# EAGLE board InkTime_Schematic (EAGLE 9.7.0)
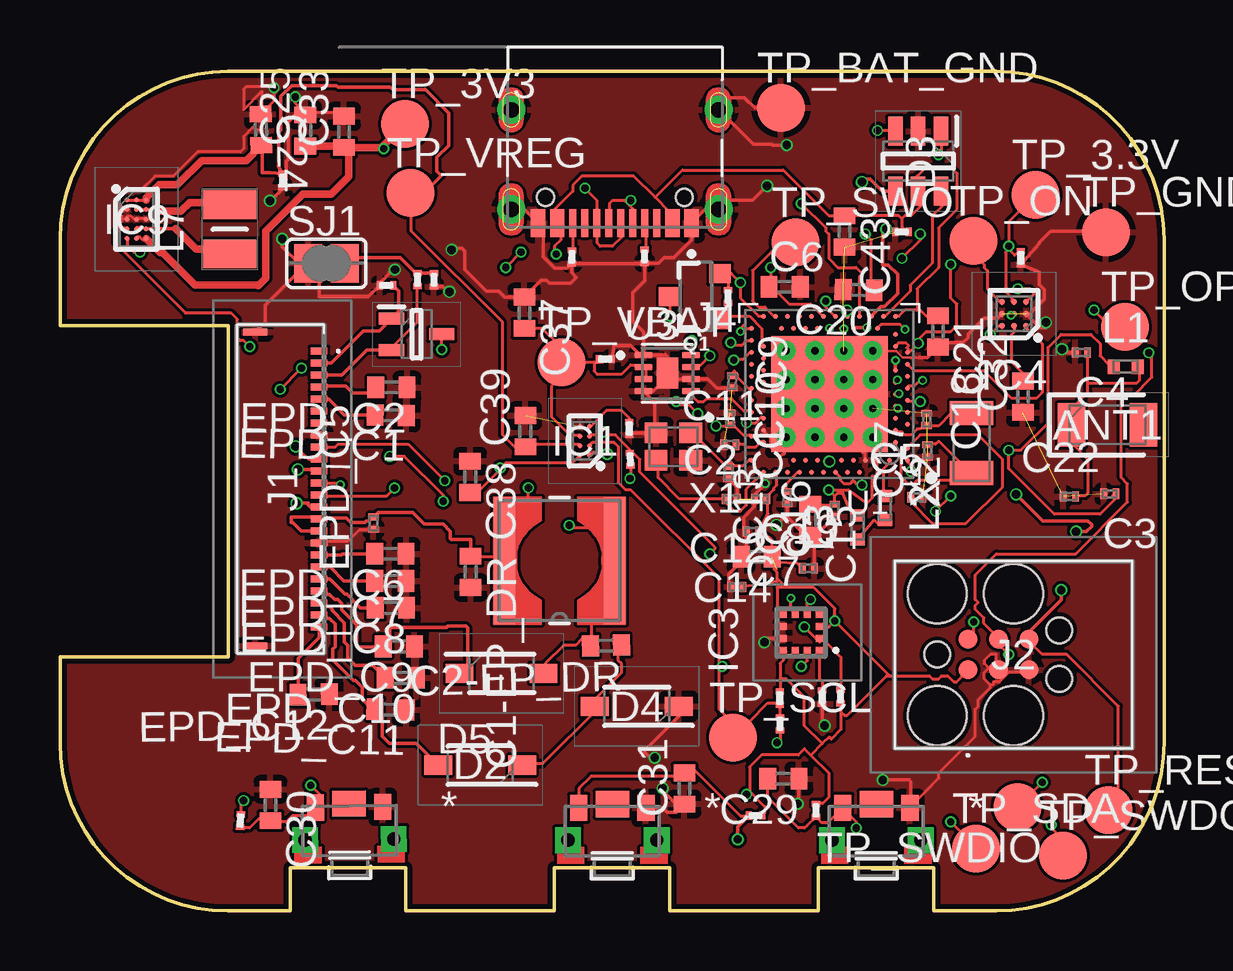
[diagram p2: board, top side]
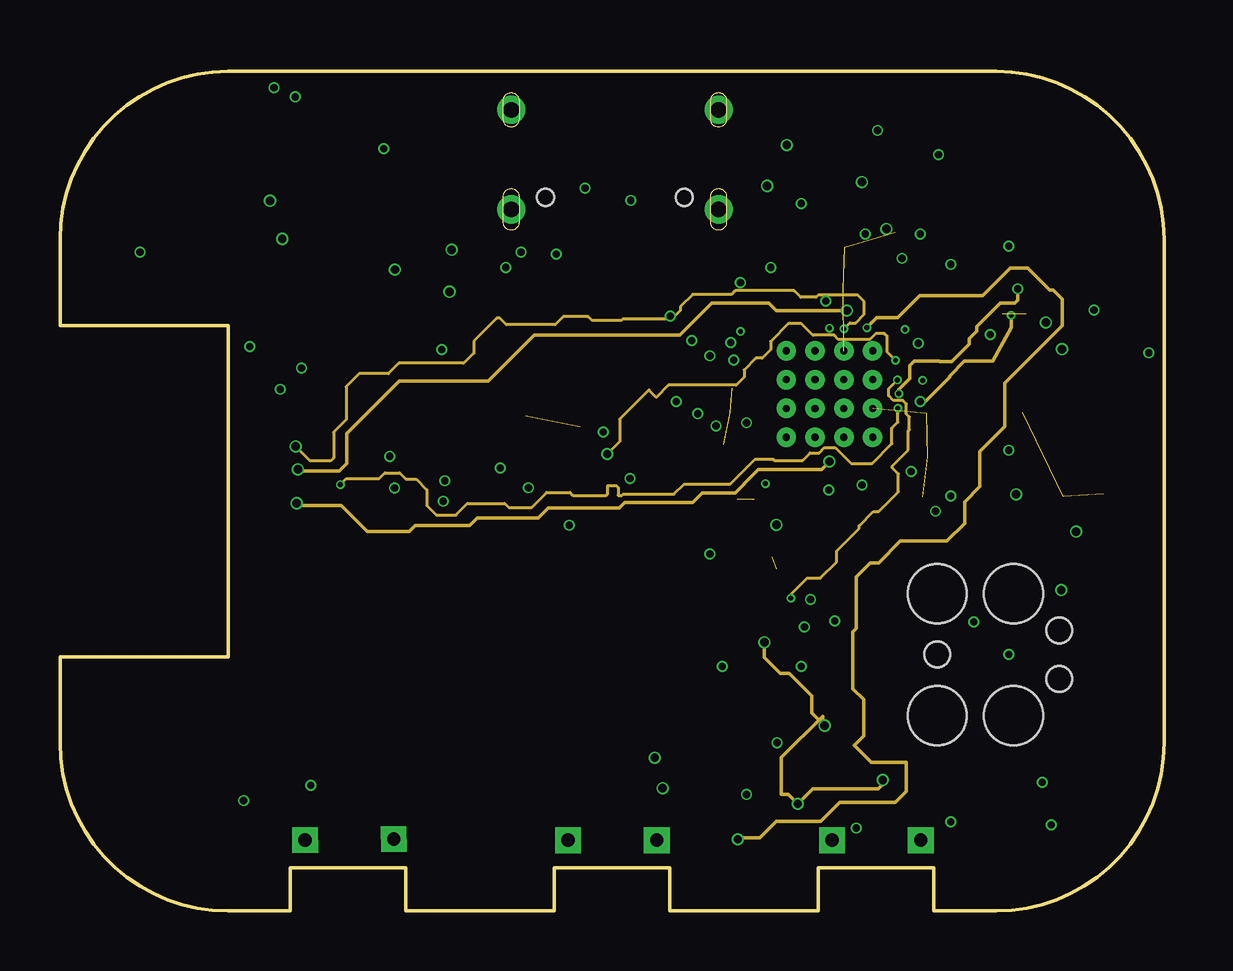
[diagram p3: board, inner layer Route2]
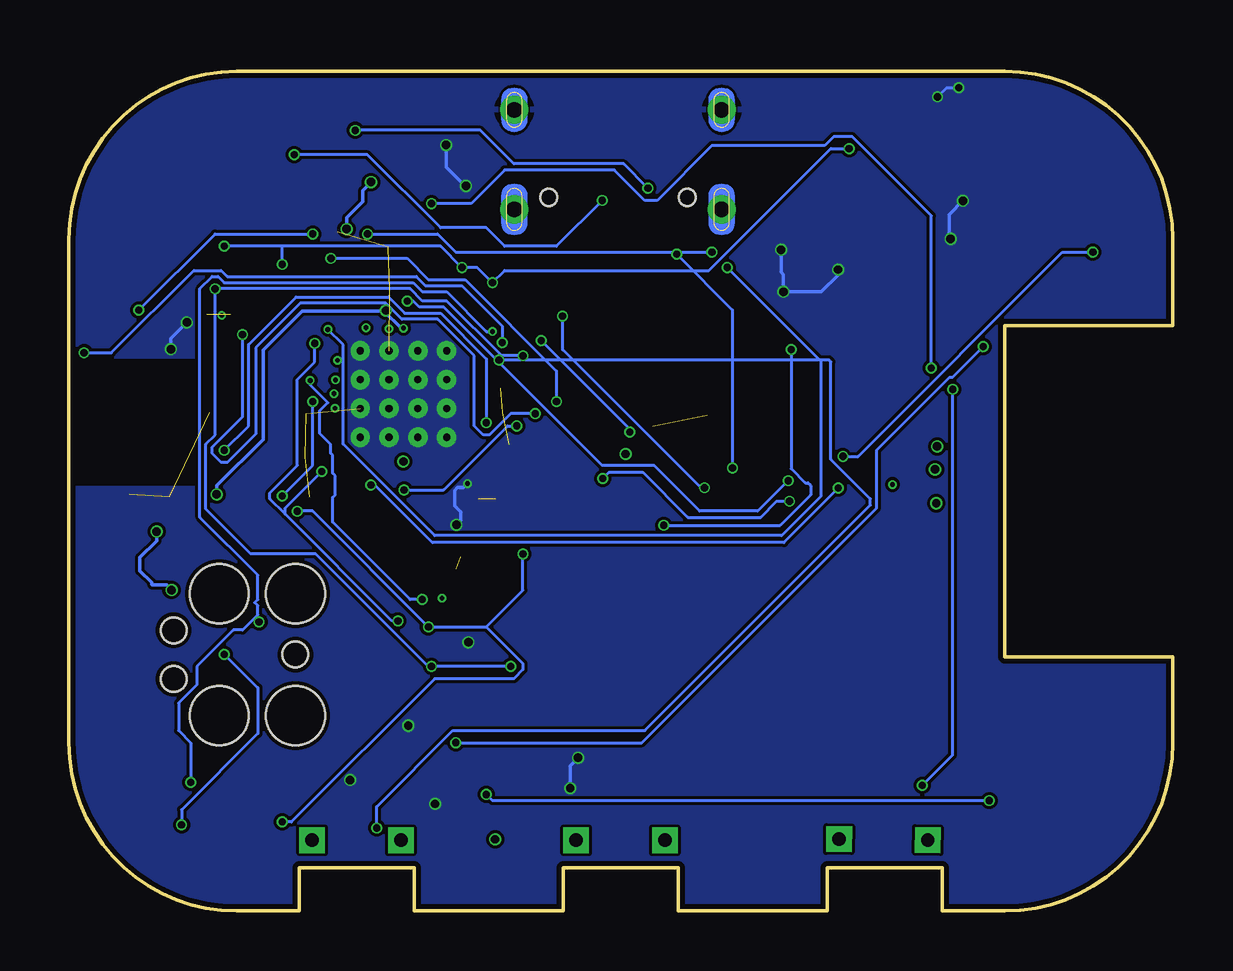
[diagram p4: board, bottom side, seen from below]

Size 46 x 35 mm. Coordinates in mm from the lower left corner, seen from the top.
Outline: 39,0 36.4,0 36.4,1.8 31.6,1.8 31.6,0 25.4,0 25.4,1.8 20.6,1.8 20.6,0 14.4,0 14.4,1.8 9.6,1.8 9.6,0 7,0 arc-90 0,7 0,10.6 7,10.6 7,24.4 0,24.4 0,28 arc-90 7,35 39,35 arc-90 46,28 46,7 arc-90 39,0
Copper layers (1+2*15+16): Top 0.035mm / dielectric 1.6mm / Route2 0.035mm / dielectric 0.15mm / Route15 0.035mm / dielectric 0.2mm / Bottom 0.035mm
Design rules "jlcpcb-2layers.dru *": minimum track width 0.06mm, minimum drill 0.2mm, track to track 5mil, track to pad 5mil, pad to pad 0.01mm, via to via 5mil, smd to smd 5mil, copper to edge 0.2mm, drill to drill 6mil, minimum pad ring 10mil, minimum via ring 3mil, stop-mask expansion 4mil, vias tented up to drill 0mil, thermal gap 10mil
bRestrict: area 40.8,17.7 to 46.4,23

## Footprints (pad centres in the part's own frame; a part is rotated, then mirrored left to right if it is on the bottom)
2450AT18B100E_ANTC3216X140N = smd 1.15 x 1.8: 1 -1.5,0; 2 1.5,0
NORDIC_NRF_3_RESC0201_L = smd 0.28 x 0.43: 1 -0.255,0; 2 0.255,0
ESP32_C6_LIBRARY_1_ESP32_WROVER_EAGLE-LTSPICE_C0402 = smd 0.7 x 0.9: 1 -0.65,0; 2 0.65,0
ERA-1AEB3401C_0201 = smd 0.35 x 0.25: 1 0,0.275; 2 0,-0.275
ESP32_C6_LIBRARY_5_SOD3716X135N = smd 1.15 x 0.8: 1 -1.75,0; 2 1.75,0
ESP32_C6_LIBRARY_3_SOT95P280X145-6N = smd 1.2 x 0.6: 1 -1.25,0.95; 2 -1.25,0; 3 -1.25,-0.95; 4 1.25,-0.95; 5 1.25,0; 6 1.25,0.95
BQ25180YBGR_BGA8C40P2X4_100X155X50 = smd 0.2 x 0.2: A1 -0.2,0.6; A2 0.2,0.6; B1 -0.2,0.2; B2 0.2,0.2; C1 -0.2,-0.2; C2 0.2,-0.2; D1 -0.2,-0.6; D2 0.2,-0.6
BMA423_BMA423 = smd 0.3 x 0.35: 1 -0.75,-0.775; 2 -0.25,-0.775; 3 0.25,-0.775; 4 0.75,-0.775; 7 0.75,0.775; 8 0.25,0.775; 9 -0.25,0.775; 10 -0.75,0.775 | smd 0.35 x 0.3: 5 0.775,-0.25; 6 0.775,0.25; 11 -0.775,0.25; 12 -0.775,-0.25
DRV2605YZFR_BGA9C50P3X3_144X144X62 = smd 0.25 x 0.25: A1 -0.5,0.5; A2 0,0.5; A3 0.5,0.5; B1 -0.5,0; B2 0,0; B3 0.5,0; C1 -0.5,-0.5; C2 0,-0.5; C3 0.5,-0.5
RT6160AWSC_BGA15C40P3X5_140X230X60 = smd 0.216 x 0.216: A1 -0.4,0.8; A2 0,0.8; A3 0.4,0.8; B1 -0.4,0.4; B2 0,0.4; B3 0.4,0.4; C1 -0.4,0; C2 0,0; C3 0.4,0; D1 -0.4,-0.4; D2 0,-0.4; D3 0.4,-0.4; E1 -0.4,-0.8; E2 0,-0.8; E3 0.4,-0.8
503480-2400_5034802400 = smd 0.3 x 0.7: 1 -5.75,1.525; 2 -5.25,1.525; 3 -4.75,1.525; 4 -4.25,1.525; 5 -3.75,1.525; 6 -3.25,1.525; 7 -2.75,1.525; 8 -2.25,1.525; 9 -1.75,1.525; 10 -1.25,1.525; 11 -0.75,1.525; 12 -0.25,1.525; 13 0.25,1.525; 14 0.75,1.525; 15 1.25,1.525; 16 1.75,1.525; 17 2.25,1.525; 18 2.75,1.525; 19 3.25,1.525; 20 3.75,1.525; 21 4.25,1.525; 22 4.75,1.525; 23 5.25,1.525; 24 5.75,1.525 | smd 0.3 x 1: MP1 -6.54,-1.125; MP2 6.54,-1.125
TC2030-IDC_TC2030IDC = smd 0.783 x 0.783: 1 -0.953,-0.635; 2 -0.953,0.635; 3 0.317,-0.635; 4 0.317,0.635; 5 1.588,-0.635; 6 1.588,0.635 | hole 2.451: -2.223,-2.54; -2.223,2.54; 0.952,-2.54; 0.952,2.54 | hole 1.067: -2.223,0; 2.857,-1.016; 2.857,1.016
KH-TYPE-C-16P_KINGHELM_KH-TYPE-C-16P = smd 0.6 x 1.15: A1_B12 -3.2,4.725; A4_B9 -2.4,4.725; A9_B4 2.4,4.725; A12_B1 3.2,4.725 | smd 0.3 x 1.15: A5 -1.25,4.725; A6 -0.25,4.725; A7 0.25,4.725; A8 1.25,4.725; B5 1.75,4.725; B6 0.75,4.725; B7 -0.75,4.725; B8 -1.75,4.725 | drill 0.65 pad 1.05: SH1 -4.32,0; SH2 4.32,0; SH3 -4.32,4.15; SH4 4.32,4.15 | hole 0.7: -2.89,3.65; 2.89,3.65
NORDIC_NRF_2_RESC0402_L = smd 0.5 x 0.6: 1 -0.5,0; 2 0.5,0
ESP32_C6_LIBRARY_2_IND_4828-WE-TPC_WRE = smd 0.9 x 5.3: 1 -2.286,0; 2 2.286,0
MLP2016SR47MT0S1_INDC2016X100N = smd 1.2 x 2.2: 1 -1.028,0; 2 1.028,0
ESP32_C6_LIBRARY_4_ESP32_C6_LIBRARY_4_ESP32_C6_LIBRARY_4_ESP32_C6_LIBRARY_4_ESP32_WROVER_SPARKFUN-DISCRETESEMI_SOT23-3 = smd 0.8 x 0.9: 1 -0.95,-1; 2 0.95,-1; 3 0,1.1
ESP32_C6_LIBRARY_6_SOT65P210X110-3N = smd 1.05 x 0.5: 1 -1.05,0.65; 2 -1.05,-0.65; 3 1.05,0
CPF0201D7K68C1_0201 = smd 0.35 x 0.25: 1 0,0.275; 2 0,-0.275
ESP32_C6_LIBRARY_7_JUMPER_SJ = smd 1.168 x 1.6: 1 -0.762,0; 2 0.762,0
2025-10-22_07-23-44_LIBRARY_SW_EVP-AKE31A_PAN = smd 0.711 x 1.092: 1 -1.4,-0.972; 2 1.4,-0.972 | drill 0.559 pad 0.914 square: 3 -1.848,0.381; 4 1.848,0.381 | smd 1.397 x 1.092: 5 0,-1.124
HECTOR_WATCH_1_TP20R = smd 2 x 2: TP 0,0
NORDIC_NRF_4_AQFN50P700X700X85_HS-74N = smd 4.85 x 4.85: P$74 0,0 | drill 0.3 pad 0.6: P$75 -1.8,1.8; P$76 -0.6,1.8; P$77 0.6,1.8; P$78 1.8,1.8; P$79 -1.8,0.6; P$80 -0.6,0.6; P$81 0.6,0.6; P$82 1.8,0.6; P$83 -1.8,-0.6; P$84 -0.6,-0.6; P$85 0.6,-0.6; P$86 1.8,-0.6; P$87 -1.8,-1.8; P$88 -0.6,-1.8; P$89 0.6,-1.8; P$90 1.8,-1.8 | smd 0.2 x 0.2: P$A8 -1.25,3.25; P$A10 -0.75,3.25; P$A12 -0.25,3.25; P$A14 0.25,3.25; P$A16 0.75,3.25; P$A18 1.25,3.25; P$A20 1.75,3.25; P$A22 2.25,3.25; P$A23 2.75,3.25; P$AA24 3.25,-2.25; P$AB2 -2.75,-2.5; P$AC5 -2,-2.75; P$AC9 -1,-2.75; P$AC11 -0.5,-2.75; P$AC13 0,-2.75; P$AC15 0.5,-2.75; P$AC17 1,-2.75; P$AC19 1.5,-2.75; P$AC21 2,-2.75; P$AC24 3.25,-2.75; P$AD2 -2.75,-3.25; P$AD4 -2.25,-3.25; P$AD6 -1.75,-3.25; P$AD8 -1.25,-3.25; P$AD10 -0.75,-3.25; P$AD12 -0.25,-3.25; P$AD14 0.25,-3.25; P$AD16 0.75,-3.25; P$AD18 1.25,-3.25; P$AD20 1.75,-3.25; P$AD22 2.25,-3.25; P$AD23 2.75,-3.25; P$B1 -3.25,2.75; P$B3 -2.5,2.75; P$B5 -2,2.75; P$B7 -1.5,2.75; P$B9 -1,2.75; P$B11 -0.5,2.75; P$B13 0,2.75; P$B15 0.5,2.75; P$B17 1,2.75; P$B19 1.5,2.75; P$B24 3.25,2.75; P$C1 -3.25,2.25; P$D2 -2.75,2; P$D23 2.75,2; P$E24 3.25,1.75; P$F2 -2.75,1.5; P$F23 2.75,1.5; P$G1 -3.25,1.25; P$H2 -2.75,1; P$H23 2.75,1; P$J1 -3.25,0.75; P$J24 3.25,0.75; P$K2 -2.75,0.5; P$L1 -3.25,0.25; P$L24 3.25,0.25; P$M2 -2.75,0; P$N1 -3.25,-0.25; P$N24 3.25,-0.25; P$P2 -2.75,-0.5; P$P23 2.75,-0.5; P$R1 -3.25,-0.75; P$R24 3.25,-0.75; P$T2 -2.75,-1; P$T23 2.75,-1; P$U1 -3.25,-1.25; P$U24 3.25,-1.25; P$V23 2.75,-1.5; P$W1 -3.25,-1.75; P$W24 3.25,-1.75; P$Y2 -2.75,-2; P$Y23 2.75,-2
ESP32_C6_LIBRARY_SON50P200X200X80-9N = smd 0.76 x 0.27: 1 -0.985,0.75; 2 -0.985,0.25; 3 -0.985,-0.25; 4 -0.985,-0.75; 5 0.985,-0.75; 6 0.985,-0.25; 7 0.985,0.25; 8 0.985,0.75 | smd 0.9 x 1.3: 9 0,0
NORDIC_NRF_BT-XTAL_2016_N = smd 0.95 x 0.85: 1 -0.725,-0.575; 2 0.725,-0.575; 3 0.725,0.575; 4 -0.725,0.575
NORDIC_NRF_1_XTAL_3215_N = smd 1 x 1.8: 1 -1.25,0; 2 1.25,0

## Placement (x,y rotation side)
ANT1  2450AT18B100E  [2450AT18B100E_ANTC3216X140N]  43.65,20.27 0 top
C1  12pF  [NORDIC_NRF_3_RESC0201_L]  27.85,18.27 270 top
C1-EP_DR  10uF  [ESP32_C6_LIBRARY_1_ESP32_WROVER_EAGLE-LTSPICE_C0402]  17.11,14.14 270 top
C2  12pF  [NORDIC_NRF_3_RESC0201_L]  27.96,17.18 0 top
C2-EP_DR  4.7uF/25V  [ESP32_C6_LIBRARY_1_ESP32_WROVER_EAGLE-LTSPICE_C0402]  22.75,11.07 181.5 top
C3  1pF  [NORDIC_NRF_3_RESC0201_L]  43.74,17.39 180 top
C4  1pF  [NORDIC_NRF_3_RESC0201_L]  42.56,23.28 180 top
C5  100nF  [NORDIC_NRF_3_RESC0201_L]  35.7,17.25 0 top
C6  4.7μF  [ESP32_C6_LIBRARY_1_ESP32_WROVER_EAGLE-LTSPICE_C0402]  30.19,26.02 0 top
C7  100nF  [NORDIC_NRF_3_RESC0201_L]  28.85,15.82 180 top
C8  100nF  [NORDIC_NRF_3_RESC0201_L]  29.19,17.18 180 top
C9  820pF N.C.  [NORDIC_NRF_3_RESC0201_L]  28.01,22.06 268.5 top
C10  N.C.  [NORDIC_NRF_3_RESC0201_L]  27.93,20.52 270 top
C11  100pF  [NORDIC_NRF_3_RESC0201_L]  27.91,19.44 0 top
C12  100nF  [NORDIC_NRF_3_RESC0201_L]  28.2,13.51 0 top
C13  N.C.  [NORDIC_NRF_3_RESC0201_L]  30.3,17.23 89.8 top
C14  4.7μF  [ESP32_C6_LIBRARY_1_ESP32_WROVER_EAGLE-LTSPICE_C0402]  29.03,14.77 180 top
C15  1.0μF  [ESP32_C6_LIBRARY_1_ESP32_WROVER_EAGLE-LTSPICE_C0402]  31.26,16.31 270 top
C16  47nF  [NORDIC_NRF_3_RESC0201_L]  32.28,16.7 90 top
C17  12pF  [NORDIC_NRF_3_RESC0201_L]  36.15,19.18 90 top
C18  12pF  [NORDIC_NRF_3_RESC0201_L]  36.11,20.49 270 top
C19  100nF  [NORDIC_NRF_3_RESC0201_L]  31.18,14.29 0 top
C20  4.7μF  [ESP32_C6_LIBRARY_1_ESP32_WROVER_EAGLE-LTSPICE_C0402]  33.28,25.89 178.5 top
C21  4.7μF  [ESP32_C6_LIBRARY_1_ESP32_WROVER_EAGLE-LTSPICE_C0402]  36.58,24.16 269.8 top
C22  N.C.  [NORDIC_NRF_3_RESC0201_L]  42.05,17.28 0 top
C23  0.1uF  [ERA-1AEB3401C_0201]  9.27,30.46 180 top
C24  10uF  [ESP32_C6_LIBRARY_1_ESP32_WROVER_EAGLE-LTSPICE_C0402]  8.37,32.57 271.6 top
C25  22uF  [ESP32_C6_LIBRARY_1_ESP32_WROVER_EAGLE-LTSPICE_C0402]  10.22,32.54 90 top
C27  0.1uF  [ERA-1AEB3401C_0201]  22.72,23.01 270 top
C29  1uF  [ESP32_C6_LIBRARY_1_ESP32_WROVER_EAGLE-LTSPICE_C0402]  30.14,5.52 180 top
C30  1uF  [ESP32_C6_LIBRARY_1_ESP32_WROVER_EAGLE-LTSPICE_C0402]  8.77,4.42 270 top
C31  1uF  [ESP32_C6_LIBRARY_1_ESP32_WROVER_EAGLE-LTSPICE_C0402]  26.02,5.11 90 top
C32  1uF  [ESP32_C6_LIBRARY_1_ESP32_WROVER_EAGLE-LTSPICE_C0402]  40.12,21.44 90 top
C33  22uF  [ESP32_C6_LIBRARY_1_ESP32_WROVER_EAGLE-LTSPICE_C0402]  11.83,32.48 90 top
C34  0.1uF  [ERA-1AEB3401C_0201]  40.03,27.23 180 top
C37  1uF  [ESP32_C6_LIBRARY_1_ESP32_WROVER_EAGLE-LTSPICE_C0402]  19.35,24.94 270 top
C38  1uF  [ESP32_C6_LIBRARY_1_ESP32_WROVER_EAGLE-LTSPICE_C0402]  17.09,18.1 270 top
C39  10uF  [ESP32_C6_LIBRARY_1_ESP32_WROVER_EAGLE-LTSPICE_C0402]  19.39,20 90 top
C42  0.1uF  [ERA-1AEB3401C_0201]  35.08,28.31 270 top
C43  4.7uF  [ESP32_C6_LIBRARY_1_ESP32_WROVER_EAGLE-LTSPICE_C0402]  32.69,28.33 270 top
D2  MBR0530  [ESP32_C6_LIBRARY_5_SOD3716X135N]  17.51,6.08 180 top
D3  USBLC6-2SC6Y  [ESP32_C6_LIBRARY_3_SOT95P280X145-6N]  35.76,31.26 270 top
D4  MBR0530  [ESP32_C6_LIBRARY_5_SOD3716X135N]  24.03,8.53 180 top
D5  MBR0530  [ESP32_C6_LIBRARY_5_SOD3716X135N]  18.4,9.91 0 top
EPD_C1  1uF/50V  [ESP32_C6_LIBRARY_1_ESP32_WROVER_EAGLE-LTSPICE_C0402]  13.78,20.67 178.9 top
EPD_C2  1uF/50V  [ESP32_C6_LIBRARY_1_ESP32_WROVER_EAGLE-LTSPICE_C0402]  13.81,21.83 180 top
EPD_C5  0.1uF/50V  [NORDIC_NRF_3_RESC0201_L]  13.06,16.17 90 top
EPD_C6  1uF/50V  [ESP32_C6_LIBRARY_1_ESP32_WROVER_EAGLE-LTSPICE_C0402]  13.77,14.89 180 top
EPD_C7  1uF/50V  [ESP32_C6_LIBRARY_1_ESP32_WROVER_EAGLE-LTSPICE_C0402]  13.77,13.76 180 top
EPD_C8  1uF/50V  [ESP32_C6_LIBRARY_1_ESP32_WROVER_EAGLE-LTSPICE_C0402]  13.79,12.64 180 top
EPD_C9  1uF/50V  [ESP32_C6_LIBRARY_1_ESP32_WROVER_EAGLE-LTSPICE_C0402]  14.12,11.03 180 top
EPD_C10  1uF/50V  [ESP32_C6_LIBRARY_1_ESP32_WROVER_EAGLE-LTSPICE_C0402]  14.2,9.72 180 top
EPD_C11  1uF/50V  [ESP32_C6_LIBRARY_1_ESP32_WROVER_EAGLE-LTSPICE_C0402]  13.77,8.4 178.9 top
EPD_C12  1uF/50V  [ESP32_C6_LIBRARY_1_ESP32_WROVER_EAGLE-LTSPICE_C0402]  10.57,9.03 180.7 top
IC1  BQ25180YBGR  [BQ25180YBGR_BGA8C40P2X4_100X155X50]  21.87,19.6 180 top
IC3  BMA421  [BMA423_BMA423]  30.88,11.61 90 top
IC4  DRV2605YZFR  [DRV2605YZFR_BGA9C50P3X3_144X144X62]  39.75,24.89 180 top
IC9  RT6160AWSC  [RT6160AWSC_BGA15C40P3X5_140X230X60]  3.19,28.84 0 top
J1  503480-2400  [503480-2400_5034802400]  9.27,17.59 270 top
J2  TC2030-IDC  [TC2030-IDC_TC2030IDC]  38.78,10.69 0 top
J4  KH-TYPE-C-16P  [KH-TYPE-C-16P_KINGHELM_KH-TYPE-C-16P]  23.12,33.4 180 top
L1  3.9nH  [NORDIC_NRF_2_RESC0402_L]  44.4,22.69 0 top
L2  10uH  [NORDIC_NRF_2_RESC0402_L]  34.37,16.8 270 top
L3  15nH  [NORDIC_NRF_2_RESC0402_L]  33.23,15.99 90 top
L5  68uH  [ESP32_C6_LIBRARY_2_IND_4828-WE-TPC_WRE]  20.81,14.61 180 top
L7  FTC252012SR47MBCA  [MLP2016SR47MT0S1_INDC2016X100N]  7.07,28.42 270 top
Q1  20V/4.2A/52mΩ/1.4W  [ESP32_C6_LIBRARY_4_ESP32_C6_LIBRARY_4_ESP32_C6_LIBRARY_4_ESP32_C6_LIBRARY_4_ESP32_WROVER_SPARKFUN-DISCRETESEMI_SOT23-3]  26.5,25.62 90 top
Q3  SI1308EDL-T1-GE3  [ESP32_C6_LIBRARY_6_SOT65P210X110-3N]  14.86,24.04 0 top
R1_EP_DR  0.47  [CPF0201D7K68C1_0201]  14.9,26.32 0.3 top
R1_USB  5K1  [ERA-1AEB3401C_0201]  24.36,27.29 180 top
R2  0  [CPF0201D7K68C1_0201]  23.76,18.83 2.8 top
R2_EP_DR  10K  [CPF0201D7K68C1_0201]  13.6,26.08 90 top
R2_USB  5K1  [ERA-1AEB3401C_0201]  21.33,27.27 358.6 top
R3  0  [CPF0201D7K68C1_0201]  31.76,8.92 180 top
R4  0  [CPF0201D7K68C1_0201]  30,7.8 0 top
R5  10K  [ERA-1AEB3401C_0201]  7.52,3.77 176.7 top
R7  10K  [ERA-1AEB3401C_0201]  31.5,4.2 180 top
R8  10K  [ERA-1AEB3401C_0201]  28.98,3.98 91.2 top
R9  10K  [CPF0201D7K68C1_0201]  23.72,20.11 180 top
R17  3K3  [CPF0201D7K68C1_0201]  29.99,8.87 0 top
R18  3K3  [CPF0201D7K68C1_0201]  32.52,8.94 180 top
R_PWR_EPD  10K  [CPF0201D7K68C1_0201]  27.84,25.62 180 top
R_TYPE_SEL  2.2  [CPF0201D7K68C1_0201]  15.58,26.31 180 top
SJ1  [ESP32_C6_LIBRARY_7_JUMPER_SJ]  11.1,27 0 top
SW_DN  2025-10-22_07-23-44_LIBRARY_EVP-AKE31ASW_EVP-AKE31A_PAN  [2025-10-22_07-23-44_LIBRARY_SW_EVP-AKE31A_PAN]  34.02,3.33 180 top
SW_ENT  2025-10-22_07-23-44_LIBRARY_EVP-AKE31ASW_EVP-AKE31A_PAN  [2025-10-22_07-23-44_LIBRARY_SW_EVP-AKE31A_PAN]  23.02,3.33 180 top
SW_UP  2025-10-22_07-23-44_LIBRARY_EVP-AKE31ASW_EVP-AKE31A_PAN  [2025-10-22_07-23-44_LIBRARY_SW_EVP-AKE31A_PAN]  12.06,3.36 180.6 top
TP_3.3V  HECTOR_WATCH_1_TPTP20R  [HECTOR_WATCH_1_TP20R]  40.65,29.86 0 top
TP_3V3  HECTOR_WATCH_1_TPTP20R  [HECTOR_WATCH_1_TP20R]  14.37,32.82 0 top
TP_BAT_GND  HECTOR_WATCH_1_TPTP20R  [HECTOR_WATCH_1_TP20R]  30.04,33.48 0 top
TP_GND  HECTOR_WATCH_1_TPTP20R  [HECTOR_WATCH_1_TP20R]  43.58,28.3 0 top
TP_ON  HECTOR_WATCH_1_TPTP20R  [HECTOR_WATCH_1_TP20R]  38.07,27.93 0 top
TP_OP  HECTOR_WATCH_1_TPTP20R  [HECTOR_WATCH_1_TP20R]  44.37,24.36 0 top
TP_RESET  HECTOR_WATCH_1_TPTP20R  [HECTOR_WATCH_1_TP20R]  43.68,4.21 0 top
TP_SCL  HECTOR_WATCH_1_TPTP20R  [HECTOR_WATCH_1_TP20R]  28.04,7.22 0 top
TP_SDA  HECTOR_WATCH_1_TPTP20R  [HECTOR_WATCH_1_TP20R]  38.17,2.61 0 top
TP_SWDCLK  HECTOR_WATCH_1_TPTP20R  [HECTOR_WATCH_1_TP20R]  41.8,2.31 0 top
TP_SWDIO  HECTOR_WATCH_1_TPTP20R  [HECTOR_WATCH_1_TP20R]  39.9,4.34 180 top
TP_SWO  HECTOR_WATCH_1_TPTP20R  [HECTOR_WATCH_1_TP20R]  30.65,27.87 0 top
TP_VBAT  HECTOR_WATCH_1_TPTP20R  [HECTOR_WATCH_1_TP20R]  20.9,22.88 0 top
TP_VREG  HECTOR_WATCH_1_TPTP20R  [HECTOR_WATCH_1_TP20R]  14.6,29.93 0 top
U1  NRF52840_QF  [NORDIC_NRF_4_AQFN50P700X700X85_HS-74N]  32.06,21.55 180 top
U3  MAX17048G+T10  [ESP32_C6_LIBRARY_SON50P200X200X80-9N]  25.3,22.42 0 top
X1  32MHz  [NORDIC_NRF_BT-XTAL_2016_N]  25.56,19.36 180 top
X2  32.768kHz  [NORDIC_NRF_1_XTAL_3215_N]  37.98,19.52 90 top

## Tracks (layer width: path | path; a pad name or v marks a point on that pad's centre or on a via)
3V3  (via drill 0.3)  (1 unrouted)
  Top 0.127: 39.53,27.59 39.78,27.34 C34.2 | 39.53,27.59 v39.53,27.72 39.53,28.73 40.54,29.75 TP_3.3V.TP | 39.53,27.59 39.4,27.46 39.4,25.81 39.65,25.56 39.65,25.43 IC4.C2 | 29.62,26.07 30.38,25.3 31.27,25.3 31.78,24.8 U1.P$AD14 | IC9.E2 3.2,28.1 3.33,28.1 3.46,27.97 IC9.E3 | 27.84,26.57 27.59,26.57 Q1.2 27.84,26.57 | 27.84,26.57 27.97,26.57 v28.35,26.19 28.35,25.56 29.11,24.8 29.24,24.8 U1.P$AD23 | v13.49,31.78 13.38,31.83 | 27.84,26.57 27.84,25.94 R_PWR_EPD.2 | v29.62,26.83 29.62,26.07 | 29.62,26.07 C6.1 | 30.13,13.49 30.13,13.62 29.87,13.88 | IC3.7 29.88,12.59 29.88,13.49 30.13,13.49 | 29.87,13.88 29.87,13.74 C12.2 | 29.87,13.88 29.87,14.13 29.75,14.26 29.86,14.26 | C19.1 30.73,14.49 29.86,14.53 29.86,14.68 C14.1 29.65,15.5 29.64,15.51 C7.1 29.49,16.59 29.49,17.18 C8.1 29.41,17.23 29.75,17.57 29.75,17.64 29.87,17.77 29.87,18.32 U1.P$A22 | 35.41,23.35 35.43,23.33 35.59,23.5 | 35.41,23.35 35.27,23.48 35.36,23.57 35.26,23.68 34.94,23.68 U1.P$Y2 | v35.46,18.32 35.59,18.45 35.34,18.7 U1.P$B1 | v32.29,12.1 32.03,11.84 31.78,11.84 IC3.3 | 35.41,23.35 35.34,23.27 U1.P$W1 | 30.13,13.49 31.4,13.49 32.29,12.61 v32.29,12.1 | 30,9.68 30,10.32 30.13,10.45 30.13,10.7 30.26,10.83 30.13,10.95 IC3.10 | 30,9.68 30,9.18 R17.1 | 28.73,4.99 29.37,4.35 29.37,4.1 R8.2 | 28.73,4.99 28.73,6 29.24,6.51 30.76,6.51 31.02,6.76 31.28,6.5 | 31.76,6.98 32.04,7.26 32.14,7.17 32.54,7.57 32.54,8.29 | 31.76,6.98 31.28,6.5 | 32.54,8.29 32.54,8.54 R18.1 | v7.65,4.6 7.52,4.48 7.52,4.1 R5.2 | 28.73,4.99 v28.6,4.86 | R7.2 31.51,4.49 31.78,4.49 32.02,4.73 32.02,5.76 31.28,6.5 | 34.57,9.81 34.45,9.81 32.8,8.16 32.67,8.16 32.54,8.29
  Top 0.127: 34.57,9.81 36.22,9.81 36.35,9.68 36.61,9.68 36.73,9.81 36.99,9.81 37.24,9.56 37.37,9.56 37.75,9.94 J2.1 | 30,9.68 30.26,9.68 31.02,8.92 31.02,7.73 31.76,6.98 | 34.57,9.81 v32.29,12.1 | v37.11,26.96 37.11,25.56 37.37,25.3 37.37,24.42 37.11,24.16 36.1,24.16 35.59,23.65 35.59,23.5 | 35.59,23.5 v35.76,23.66
  Top 0.305: C25.1 11.77,31.89 C33.1 | C33.1 13.38,31.83 TP_3V3.TP | IC9.E3 4.18,27.45 4.28,27.45 5.63,26.1 8.23,26.1 8.25,26.08 8.56,26.39 8.56,28.34 10.11,29.89 11.31,29.89 12.04,30.62 12.04,31.62 C33.1
  Bottom 0.127: v13.49,31.78 14.25,31.78 19.33,26.7 27.84,26.7 v28.35,26.19 28.98,26.83 v29.62,26.83 30.51,27.72 37.11,27.72 | 37.11,27.72 v39.53,27.72 | v35.46,18.32 36.99,16.8 36.99,16.54 | 36.99,16.54 32.54,12.1 v32.29,12.1 | v35.76,23.66 35.76,22.89 36.48,22.17 36.48,18.57 37.62,17.43 37.62,17.18 36.99,16.54 | v7.65,4.6 28.35,4.6 v28.6,4.86 | v37.11,26.96 37.11,27.72
ALERT
  Top 0.127: U1.P$J24 28.73,20.86 28.48,20.86 27.97,21.37 26.95,21.37 26.83,21.24 26.57,21.24 26.32,21.5 26.45,21.62 26.32,21.75 U3.5
D+  (via drill 0.35)
  Top 0.15: U1.P$AD6 34.2,25.19 34.35,25.19 34.9,25.74 34.9,26.55 34.52,26.93 34.28,26.93 34.28,28.28 v34.43,28.43 | D3.4 34.27,30.01 33.76,30.52 33.54,30.52 v33.41,30.39
  Bottom 0.15: v33.41,30.39 33.76,30.04 33.76,29.57 34.43,28.9 v34.43,28.43
D-
  Top 0.127: U1.P$AD4 34.36,24.78 35.42,25.84 35.42,26.09 36.35,27.02 36.35,28.99 36.73,29.37 36.73,30 D3.6
DN  (via drill 0.3)
  Top 0.127: 23.65,29.5 23.91,29.24 23.91,28.73 J4.B7 | 23.65,29.5 23.52,29.62 23.02,29.62 22.89,29.5 22.89,28.73 J4.A7 | v36.61,31.53 36.73,31.65 36.73,32.42 D3.1 | 23.65,29.5 v23.78,29.62
  Bottom 0.127: v36.61,31.53 33.56,31.53 30.51,28.48 28.6,28.48 27.84,27.72 25.68,27.72 v23.78,29.62
DP  (via drill 0.3)
  Top 0.127: J4.A6 23.4,28.61 23.4,28.1 23.02,27.72 22.51,27.72 22.38,27.84 22.38,28.61 J4.B6 22.38,28.73 22.38,29.62 v21.87,30.13 | v34.07,32.54 34.7,32.54 D3.3
  Bottom 0.127: v34.07,32.54 28.86,32.54 27.46,31.15 22.89,31.15 v21.87,30.13
EPD_3V3  (via drill 0.3)
  Top 0.127: v25.43,24.8 25.43,25.56 Q1.3 | v19.52,17.65 19.52,15.96 18.57,15.02 18.57,14.76 | 18.57,14.76 18.57,14.64 L5.2 18.57,14.76 | 18.57,14.76 17.17,14.76 C1-EP_DR.1
  Top 0.15: 10.81,15.86 J1.16 10.06,15.84 9.7,16.2 9.64,16.2 9.64,16.43 10.71,16.43 J1.15 10.83,16.38 11.93,16.38 12.12,16.19 12.69,16.19 12.76,16.26 12.89,16.26 EPD_C5.2 13.26,16.62 14.69,16.62 15.17,16.14 15.96,16.14 16.27,15.83 16.27,15.53 16.31,15.49 17.12,15.49 17.12,14.84 17.11,14.83
  Top 0.305: 17.11,14.83 C1-EP_DR.1
  Bottom 0.127: v25.43,24.8 25.43,23.4 19.68,17.65 v19.52,17.65
EPD_BUSY  (via drill 0.3)
  Top 0.127: v31.91,25.43 31.78,25.3 32.29,24.8 U1.P$AD12 | v16.03,17.94 14.51,19.46 11.59,19.46 11.46,19.34 10.82,19.34 J1.9
  Bottom 0.127: v31.91,25.43 31.65,25.43 31.4,25.18 30.38,25.18 23.78,18.57 21.62,18.57 19.71,16.67 17.3,16.67 v16.03,17.94
EPD_CS  (via drill 0.2)
  Top 0.127: U1.P$K2 v34.91,20.96 | J1.12 11.62,17.84 v11.68,17.78
  Route2 0.127: v11.68,17.78 11.93,18.03 13.3,18.03 13.54,18.27 14.15,18.27 14.41,18.01 14.84,18.01 15.29,17.56 15.29,16.9 15.68,16.51 16.49,16.51 16.97,16.99 18.53,16.99 18.7,16.82 19.65,16.82 20.28,17.45 21.25,17.45 21.37,17.33 22.75,17.33 22.82,17.4 22.82,17.73 23.18,17.73 23.26,17.65 23.26,17.33 23.41,17.33 23.46,17.38 25.58,17.38 26,17.8 27.92,17.8 28.96,18.84 29.72,18.84 29.77,18.79 30.94,18.79 31.25,19.1 31.63,19.1 31.85,19.32 32.3,19.32 32.96,18.66 33.84,18.66 34.66,19.48 34.66,20.13 34.91,20.38 v34.91,20.96
EPD_DC  (via drill 0.35)
  Top 0.152: U1.P$AD10 32.81,25.01 v32.79,25.03 | v9.91,18.41 10.72,18.41 J1.11
  Route2 0.152: v32.79,25.03 29.85,25.03 29.53,25.35 27.15,25.35 25.82,24.02 19.77,24.02 17.85,22.1 14.14,22.1 11.94,19.9 11.94,18.65 11.63,18.34 9.98,18.34 v9.91,18.41
EPD_RST  (via drill 0.2, 0.35)
  Top 0.127: U1.P$AC11 32.63,24.3 v32.66,24.27 | v9.82,19.37 10.35,18.84 J1.10
  Route2 0.127: v32.66,24.27 32.91,24.52 33.15,24.52 33.51,24.88 33.51,25.4 33.24,25.67 31.59,25.67 31.51,25.59 30.86,25.59 30.59,25.86 28.14,25.86 27.98,25.7 26.36,25.7 25.85,25.19 25.85,25.04 25.49,24.68 23.45,24.68 23.39,24.62 22.17,24.62 22.01,24.78 20.97,24.78 20.63,24.44 18.6,24.44 18.33,24.71 18.2,24.71 17.24,23.75 17.24,23.26 16.82,22.84 14.12,22.84 13.68,22.4 12.46,22.4 11.92,21.86 11.92,20.48 11.4,19.96 11.4,18.89 11.28,18.77 10.42,18.77 v9.82,19.37
GDR
  Top 0.15: J1.2 11.3,22.84 12.64,24.18 13.29,24.18 Q3.1 14.12,25 14.12,25.84 R2_EP_DR.2
GND  (via drill 0.2, 0.3, 0.35)  (13 unrouted)
  Top 0.102: 35.79,23.07 35.12,23.07 34.85,23.34 U1.P$87
  Top 0.127: 38.76,9.43 38.51,9.68 38.51,9.94 39.02,10.45 39.02,10.7 38.76,10.7 38.51,10.45 38.51,10.32 38.76,10.07 39.02,10.07 J2.3 | 38.76,9.43 38.89,9.43 38.89,9.56 39.15,9.56 39.53,9.94 40.29,9.94 J2.5 | 3.2,28.86 3.08,28.86 2.95,28.99 2.82,28.99 2.7,28.86 IC9.C1 | U1.P$B7 33.56,19.06 33.43,19.12 33.43,19.34 33.81,19.72 | U1.P$F23 29.37,19.97 29.62,19.72 29.62,19.34 29.61,19.32 29.99,18.94 30.09,19.04 30.18,19.04 30.18,19.64 U1.P$74 33.81,19.72 | 33.81,19.72 U1.P$75 | 38.76,9.43 38.76,9.3 38.26,8.79 38.26,8.54 38.13,8.41 38.13,7.27 36.62,5.76 36.62,5.55 35.46,4.35 SW_DN.1 | 3.2,28.86 3.59,28.86 IC9.C3 | 3.2,28.86 IC9.C2 | v9.81,33.94 9.81,33.69 10.19,33.31 C25.2 10.33,33.3 11.66,33.3 C33.2 | IC9.B1 2.7,29.24 2.31,28.86 2.44,28.73 2.57,28.73 2.57,28.99 2.44,29.11 2.31,29.11 2.31,29.24 2.44,29.24 2.57,29.37 2.44,29.5 2.44,29.75 2.7,30 3.33,30 3.97,30.64 4.73,30.64 5.74,31.65 7.52,31.65 7.65,31.78 7.65,32.29 8.03,32.67 8.16,32.54 8.41,32.54 8.41,33.05 8.28,33.05 8.16,33.18 8.16,33.31 8.28,33.43 8.41,33.43 8.41,34.17 7.65,33.41 7.65,34.25 7.76,34.37 8.87,34.37 v8.92,34.32 8.92,33.79 C24.1 | J1.17 10.88,15.43 12.01,15.43 12.49,15.91 EPD_C5.1
  Top 0.15: R9.1 23.82,19.93 X1.2 24.79,19.98 24.79,21.2 U3.4 24.72,21.67 25.39,22.34 | C1.2 28.21,17.65 C2.2 | C15.2 31.06,15.66 30.3,16.42 30.3,16.55 | v29.39,17.82 v29.4,17.81 28.94,17.34 C8.2 28.94,16.86 28.48,16.4 28.48,15.93 C7.2 28.6,14.98 C14.2 28.38,14.56 27.87,14.05 27.87,13.59 C12.1 | v29.85,16.1 30.3,16.55 | 30.3,16.55 C13.1 | SW_ENT.1 25.12,4.3 25.3,4.12 25.68,4.12 C31.1 25.65,4.46 25.11,5 v25.11,5.12 | TP_BAT_GND.TP 28.94,33.48 28.52,33.9 27.94,33.9 J4.SH1 28.88,31.96 29.65,31.96 29.68,31.93 v30.28,31.93 | v29.46,30.23 28.87,29.64 27.83,29.64 J4.SH3 26.9,29.25 J4.A1_B12 26.32,27.98 25.58,27.24 25.18,27.24 24.96,27.02 R1_USB.1 | R2_USB.2 22.7,27 22.71,26.98 24.33,26.98 R1_USB.1 | J4.SH4 19.35,29.25 J4.A12_B1 | J4.A12_B1 19.97,28.62 | J1.MP1 8.56,24.55 8.56,25.25 10.31,27 SJ1.1 | SJ1.1 9.94,27 9.26,27.68 v9.26,28.02 | v8.75,29.61 8.78,29.61 9.46,30.29 C23.1 9.42,30.5 9.42,31.25 9.5,31.33 9.5,32.86 9.49,32.87 9.81,33.19 C25.2 | SJ1.1 10.8,26.54 10.8,25.61 12.85,25.61 R2_EP_DR.1 13.33,26.17 13.72,26.57 13.72,26.64 13.82,26.74 v13.95,26.74 | R_TYPE_SEL.1 15.94,26.04 16.16,25.82 v16.23,25.82 | v16.32,27.57 16.38,27.63 16.74,27.63 16.87,27.5 16.87,26.74 17.77,25.84 18.29,25.84 18.54,25.59 C37.1 20.06,26.3 20.26,26.3 20.39,26.18 21.29,26.18 21.52,26.41 21.32,26.61 R2_USB.2 | J4.A12_B1 20.13,28.46 20.13,27.28 20.61,26.8 21.13,26.8 R2_USB.2 | C27.1 23.09,23.57 23.79,23.57 24.19,23.17 U3.1 | U3.1 24.32,24.13 23.87,24.58 23.87,25.79 24.36,26.28 R1_USB.1 | U3.1 25.18,23.17 25.21,23.2 25.3,23.11 U3.9 25.39,22.34 | 25.39,22.34 25.55,22.17 U3.6 27,22.17 27.37,21.8 C9.2
  Top 0.15: D4.1 25.78,8.11 24.37,6.7 24.37,6.61 24.59,6.39 v24.78,6.39 | TP_GND.TP 43.54,28.34 41.28,28.34 40.8,27.86 40.8,27.82 C34.1 40.8,26.64 40.8,26.12 41.01,25.91 41.01,25.52 40.38,24.89 IC4.B1 40.69,24.45 40.69,24.33 40.7,24.32 41.07,24.32 41.08,24.33 v41.08,24.54 | C15.2 31.44,15.48 C19.2 | C15.2 31.5,15.66 C16.1 | C29.1 30.79,4.52 v30.74,4.47 | v34.28,5.46 35.39,5.46 35.46,5.39 35.46,4.35 | v31.86,7.73 31.76,7.83 R3.1 | v29.35,11.2 29.51,11.36 IC3.9 | C4.2 41.89,23.28 v41.75,23.42 | IC4.B3 39.08,24.72 38.51,24.72 37.84,24.05 37.84,23.91 37.62,23.69 36.76,23.69 C21.2 36.14,23.07 35.79,23.07
  Route2 0.15: v34.28,5.46 34.36,5.38 34.36,5.35 34.1,5.09 31.36,5.09 v30.74,4.47 30.35,4.86 30.06,4.86 30.06,6.4 31.78,8.12 31.78,7.81 v31.86,7.73 31.33,8.26 31.33,8.96 30.38,9.91 30.02,9.91 29.35,10.58 v29.35,11.2
  Bottom 0.127: v8.92,34.32 9.43,34.32 v9.81,33.94
  Bottom 0.15: v29.39,17.82 29.56,17.65 29.81,17.65 29.92,17.54 29.92,16.88 29.67,16.63 29.67,16.28 v29.85,16.1 | v29.46,30.23 29.5,30.23 30.28,31.01 v30.28,31.93 | v8.75,29.61 9.32,29.04 9.32,28.08 v9.26,28.02 | v13.95,26.74 13.95,26.51 14.64,25.82 v16.23,25.82 16.23,26.54 16.32,26.63 v16.32,27.57 | v24.78,6.39 25.11,6.06 v25.11,5.12 | v41.08,24.54 41.75,23.87 v41.75,23.42
  pour Top: -5.48,38.24 -5.5,38.22 -5.52,38.2 -10.06,38.2 -10.06,-8.59 55.05,-8.59 55.05,38.41 -4.93,38.41 -4.95,38.43 -4.97,38.45 -4.99,38.47 -4.99,38.62 -5.46,38.62 -5.46,38.26
  pour Bottom: -7.34,41.26 -7.35,41.26 -7.88,41.26 -7.9,41.28 -8.06,41.43 -10.13,41.43 -25.44,26.12 17.69,-17.01 44.99,-17.01 51.88,-10.12 51.88,39.83 50.44,41.27 -7.31,41.27 -7.31,41.27 -7.32,41.27 -7.33,41.26 -7.34,41.26
HAPTIC_EN
  Top 0.127: U1.P$U1 35.34,22.77 35.59,22.51 38.51,22.51 39.65,21.37 40.67,21.37 40.92,21.62 40.92,23.65 40.29,24.29 IC4.A1
IMU_INT1  (via drill 0.2, 0.3)
  Top 0.127: v35.94,22.12 35.89,22.17 35.59,21.88 35.34,21.88 U1.P$N1 | v31.27,12.99 31.14,12.86 31.14,12.48 IC3.5
  Bottom 0.127: v35.94,22.12 35.94,21.94 35.2,21.2 35.54,20.86 35.54,19.9 35.09,19.45 35.09,19.09 35.01,19.01 35.01,18.25 34.91,18.15 34.91,17.34 35.01,17.24 35.01,16.21 31.78,12.99 v31.27,12.99
IMU_INT2  (via drill 0.2)
  Top 0.127: U1.P$P2 v34.89,22.14 | IC3.6 30.45,12.57 v30.45,13.04
  Route2 0.127: v30.45,13.04 30.45,13.2 31.13,13.88 31.68,13.88 32.36,14.56 32.36,15.01 33.3,15.95 33.3,16.06 33.89,16.65 34.11,16.65 34.93,17.47 34.93,18.22 34.68,18.47 34.68,18.56 35.34,19.22 35.34,20.02 35.39,20.07 35.39,20.6 35.27,20.72 35.27,21.14 35.12,21.29 34.72,21.29 34.53,21.48 34.53,21.78 v34.89,22.14
LX1
  Top 0.127: IC9.B2 3.2,29.24 3.46,29.24 IC9.B3
  Top 0.15: IC9.B3 4.11,29.24
  Top 0.305: 4.11,29.24 4.18,29.17 5.03,29.17 5.4,29.54 6.97,29.54 L7.1
LX2
  Top 0.127: IC9.D2 3.2,28.48 3.46,28.48 IC9.D3
  Top 0.15: IC9.D3 4.82,28.44
  Top 0.305: 4.82,28.44 5.67,27.59 6.87,27.59 L7.2
MOSI  (via drill 0.35)
  Top 0.152: U1.P$B13 v32.06,18.74 | v9.86,17 10.35,17 10.35,16.93 10.44,16.84 J1.14
  Route2 0.152: v32.06,18.74 31.73,18.41 29.09,18.41 28.51,17.83 28.51,17.8 28.14,17.43 26.75,17.43 26.36,17.04 23.54,17.04 23.31,16.81 20.34,16.81 19.92,16.39 17.39,16.39 17.07,16.07 14.8,16.07 14.55,15.82 12.8,15.82 11.71,16.91 9.95,16.91 v9.86,17
N$1
  Top 0.127: U1.P$C1 35.34,19.34 35.84,19.84 38.26,19.84 39.27,18.83 39.27,17.68 37.75,16.16 36.35,16.16 35.46,17.05 35.59,17.18 35.46,17.3 C5.1
N$6
  Top 0.127: IC1.D1 22.13,20.23 22.76,20.86 23.4,20.86 23.78,20.48 R9.2
N$13  (via drill 0.3)
  Top 0.127: v7.9,23.53 7.65,23.78 7.52,23.78 7.39,23.91 7.39,24.67 7.14,24.92 5.24,24.92 2.31,27.84 2.31,28.35 2.44,28.48 2.7,28.48 IC9.D1 | v29.87,7.02 30,7.14 R4.2
  Bottom 0.127: v7.9,23.53 9.17,22.26 9.3,22.26 12.35,19.21 12.35,16.8 22.13,7.02 v29.87,7.02
N$16  (via drill 0.3)
  Top 0.127: v3.33,27.46 3.08,27.46 2.82,27.72 2.82,27.97 IC9.E1 | v13.74,18.96 14.35,18.96 15.97,17.33 v15.97,17.08 | v23.75,18.04 23.78,18.06 23.78,18.45 R2.2
  Bottom 0.127: v3.33,27.46 4.6,27.46 13.11,18.96 v13.74,18.96 | v15.97,17.08 16.51,17.08 17.17,16.41 20.21,16.41 22.09,18.3 23.49,18.3 v23.75,18.04
N$29
  Top 0.127: IC3.1 31.65,10.83 31.65,9.68 31.78,9.56 31.78,9.3 R3.2
N$47  (via drill 0.2, 0.3)
  Top 0.127: v19.21,27.46 v18.57,26.83 | v33.56,28.23 33.81,27.97 33.81,26.07 33.87,26 C20.1 | v35.21,24.24 35.01,24.44 34.2,24.44 U1.P$AC5
  Bottom 0.127: v18.57,26.83 14.67,22.93 14.67,17.29 16.31,15.65 30.76,15.65 34.57,19.46 34.57,23.61 v35.21,24.24 | v19.21,27.46 29.87,27.46 30.64,28.23 v33.56,28.23
N$67
  Top 0.127: U1.P$N24 28.73,21.75 28.22,22.26 28.22,22.38 28.1,22.51 27.97,22.38 C9.1
N$79  (via drill 0.3)
  Top 0.127: v28.6,20.35 28.98,20.35 29.24,20.61 U1.P$H23 | C3.1 43.97,17.43 43.84,17.3 43.97,17.18 43.34,16.54 41.43,16.54 39.53,18.45 v39.53,19.21 40.03,19.21 41.18,20.35 41.18,23.5 41.72,24.04 42.95,24.04 43.34,23.65 43.34,23.15 43.72,22.77 43.84,22.77 L1.1
  Bottom 0.127: v28.6,20.35 28.6,23.02 30.51,24.92 32.01,24.92 32.68,25.59 36.54,25.59 38.51,23.62 38.51,20.23 v39.53,19.21
N$80
  Top 0.127: C22.2 42.32,17.3 42.7,17.3 42.83,17.43 42.83,18.83 42.19,19.46 42.19,20.23 ANT1.1 42.19,20.35 42.19,20.99 42.83,21.62 42.83,22 | 42.83,22 C4.1 | 42.83,22 44.86,22 44.99,22.13 44.99,22.64 L1.2
N$94
  Top 0.127: U1.P$B3 34.57,18.7 34.32,18.45 34.32,17.3 L2.1
N$95
  Top 0.127: L3.1 33.93,16.29 34.07,16.16 34.19,16.16 34.32,16.29 L2.2
N$96  (via drill 0.3)
  Top 0.127: U1.P$E24 28.73,19.84 28.48,19.84 27.97,20.35 C10.2 27.84,20.23 v27.33,20.23 | C15.1 31.27,16.92 32.16,16.92 C16.2 32.29,17.05 32.29,17.3 | 32.29,17.3 32.41,17.43 32.62,17.43 32.84,16.88 L3.2 | 32.29,17.3 v32.03,17.56 32.85,17.56 33.62,16.99 33.85,17.22 33.85,18.14 34.06,18.14 U1.P$B5
  Bottom 0.127: v27.33,20.23 27.71,20.23 30.38,17.56 v32.03,17.56
N$97
  Top 0.127: U1.P$A18 30.76,18.32 30.26,17.81 30.26,17.56 C13.2
N$98
  Top 0.127: U1.P$D23 29.24,19.59 28.98,19.34 28.6,19.34 28.48,19.46 28.35,19.46 28.22,19.59 28.1,19.46 C11.2
N$99
  Top 0.127: U1.P$A23 28.6,17.59 28.6,16.92 28.35,16.67 28.1,16.67 27.59,17.18 | 27.59,17.18 25.81,17.18 24.92,18.07 24.92,18.7 X1.3 | 27.59,17.18 C2.1
N$100
  Top 0.127: 27.71,18.57 27.84,18.7 27.97,18.7 28.1,18.57 28.48,18.57 28.73,18.83 U1.P$B24 | 27.71,18.57 27.84,18.45 C1.1 27.71,18.57 | 27.71,18.57 26.32,19.97 X1.1
N$103
  Top 0.127: U1.P$D2 34.83,19.46 34.83,19.29 35.04,19.07 35.04,18.1 35.34,17.81 35.59,17.81 35.72,17.94 37.62,17.94 37.88,18.19 X2.1 37.88,18.32 36.61,19.59 36.48,19.46 36.22,19.46 C17.2
N$104
  Top 0.127: U1.P$F2 34.83,19.97 35.08,19.97 35.21,19.84 35.46,19.84 35.72,20.1 35.84,20.1 36.1,20.35 C18.2 36.22,20.23 36.61,20.23 37.11,20.73 37.88,20.73 X2.2
N$109
  Top 0.127: C2-EP_DR.1 23.4,10.83 23.27,10.7 23.27,10.45 23.4,10.32 23.4,9.94 22.38,8.92 22.38,8.54 D4.2 22.38,8.41 20.1,6.13 19.33,6.13 D2.1
N$110  (via drill 0.3)
  Top 0.127: 22.13,11.34 22.13,13.24 23.02,14.13 23.02,14.51 L5.1 23.02,14.64 23.02,15.14 22.19,15.97 21.32,15.97 v21.21,16.08 | 22.13,11.34 22.13,11.08 C2-EP_DR.2 22.13,11.34 | v15.9,23.4 Q3.3 | 22.13,11.34 21.75,11.34 21.49,11.08 20.98,11.08 20.22,10.32 20.22,9.94 D5.2
  Bottom 0.127: v15.9,23.4 15.9,18.45 15.31,17.85 15.21,17.85 15.09,17.73 15.09,17.35 16.36,16.08 v21.21,16.08
N$115
  Top 0.15: SJ1.2 12.1,27.24 14.17,27.24 14.81,26.59 R1_EP_DR.1 15.57,26.59 R_TYPE_SEL.2
N$125
  Top 0.127: IC4.A2 39.78,24.29 39.78,24.16 39.65,24.04 39.65,22.89 40.16,22.38 40.16,22.13 C32.2
N$131
  Top 0.15: J1.4 10.83,21.88 11.91,21.88 12.2,21.59 12.92,21.59 EPD_C2.2
N$132
  Top 0.15: J1.5 11.19,21.34 11.85,20.68 EPD_C1.2
N$140
  Top 0.15: J1.18 11.71,14.84 11.76,14.89 EPD_C6.2
N$141
  Top 0.15: J1.19 11.26,14.34 11.83,13.77 13.11,13.77 EPD_C7.2
N$142
  Top 0.15: J1.20 11.24,13.84 11.86,13.22 11.94,13.22 12.52,12.64 EPD_C8.2
N$144
  Top 0.15: J1.22 10.94,12.69 11.23,12.69 11.35,12.57 11.35,12.52 11.85,12.02 11.85,11.22 11.99,11.08 11.99,10.55 12.3,10.24 13.03,10.24 EPD_C10.2
N$146
  Top 0.15: J1.24 10.79,11.41 9.92,10.53 EPD_C12.2
N$156
  Top 0.127: R1_USB.2 24.41,27.59 24.41,28.61 J4.A5
N$162
  Top 0.127: R2_USB.1 21.37,27.59 21.37,28.61 J4.B5
OUT+  (via drill 0.3)
  Top 0.127: v38.76,24.04 39.15,24.42 IC4.A3 | v26.57,20.73 26.19,21.11 25.81,21.11 v25.68,21.24 | v35.08,27.21 35.84,27.97 v35.84,28.23 | v43.08,25.05 43.72,24.42 44.35,24.42 TP_OP.TP
  Bottom 0.127: v38.76,24.04 38.76,20.61 40.03,19.34 40.03,19.08 39.65,18.7 39.4,18.7 38.21,19.89 38.21,23.49 36.36,25.34 32.79,25.34 32.12,24.67 30.64,24.67 29.11,23.15 29.11,20.23 28.73,19.84 28.48,19.84 27.59,20.73 v26.57,20.73 | v25.68,21.24 25.68,22.51 29.49,26.32 31.02,26.32 31.91,27.21 v35.08,27.21 | v35.84,28.23 39.91,28.23 v43.08,25.05
OUT-
  Top 0.127: IC4.C3 39.15,25.43 38.64,25.94 38.64,26.7 38.51,26.83 38.51,26.96 38.13,27.34 38.13,27.84 TP_ON.TP
P0.13  (via drill 0.3)
  Top 0.127: R5.1 7.52,3.46 7.9,3.46 8.28,3.84 8.66,3.84 C30.2 8.79,3.72 9.43,3.72 9.68,3.97 10.32,3.97 10.57,4.22 SW_UP.2 10.7,4.35 10.82,4.48 10.82,4.86 v10.44,5.24 | v30.89,29.5 31.91,28.48 31.91,28.35 32.03,28.23 32.03,27.21 32.41,26.83 33.18,26.83 33.43,26.57 33.3,26.45 U1.P$AD8 | v9.17,21.75 v10.06,22.64
  Bottom 0.127: v30.89,29.5 29.24,29.5 27.84,30.89 23.27,30.89 22,29.62 21.49,29.62 19.21,31.91 14.51,31.91 14.13,32.29 13.36,32.29 10.06,28.99 v10.06,22.64 | v9.17,21.75 9.17,6.51 v10.44,5.24
P0.14  (via drill 0.2, 0.35)
  Top 0.127: R8.1 28.6,3.97 28.35,3.97 26.45,5.87 26.06,5.87 C31.2 25.94,5.75 25.81,5.62 22.13,5.62 21.62,5.11 21.62,4.35 SW_ENT.2
  Top 0.15: U1.P$AC9 33.08,24.32 v33.62,24.32 | v28.24,2.99 28.24,3.51 R8.1
  Route2 0.15: v33.62,24.32 34.03,24.73 34.9,24.73 35.82,25.65 38.44,25.65 39.59,26.8 40.32,26.8 41.24,25.88 41.39,25.88 41.75,25.52 41.75,24.41 39.36,22.02 39.36,20.19 38.32,19.15 38.32,17.69 37.69,17.06 37.69,16.16 36.95,15.42 35.01,15.42 34.11,14.52 33.77,14.52 33.18,13.93 33.18,11.79 33.03,11.64 33.03,9.27 33.48,8.82 33.48,7.3 33.09,6.91 33.81,6.19 35.26,6.19 35.26,4.98 34.81,4.53 32.49,4.53 31.69,3.73 29.84,3.73 29.16,3.05 28.3,3.05 v28.24,2.99
P1.01
  Top 0.127: 27.84,24.8 27.71,24.8 27.59,24.67 Q1.1 27.84,24.8 | 27.84,24.8 28.73,24.8 29.24,24.29 29.24,23.53 U1.P$Y23 | 27.84,24.8 27.84,25.3 R_PWR_EPD.1
P1.02  (via drill 0.3)
  Top 0.127: v28.08,22.97 28.08,23.02 28.48,23.02 28.73,23.27 U1.P$W24 | v33.18,3.46 33.18,3.72 32.67,4.22 SW_DN.2 32.54,4.22 32,3.68 31.75,3.68 R7.1 31.12,3.55 31.02,3.46 30.76,3.46 29.49,4.73 29.49,5.49 C29.2
  Bottom 0.127: v28.08,22.97 14.33,22.97 14.25,22.89 14.25,18.83 12.6,17.18 12.6,16.92 22,7.53 30,7.53 33.18,4.35 v33.18,3.46
PMIC_INT  (via drill 0.2, 0.35)
  Top 0.15: IC1.A1 22.18,19.11 22.8,19.11 v22.8,19.05 | U1.P$T2 v34.81,22.96
  Route2 0.127: v34.81,22.96 34.46,23.31 34.46,23.97 34.35,24.08 33.99,24.08 33.74,23.83 32.43,23.83 32.26,24 31.37,24 30.89,24.48 30.35,24.48 29.61,23.74 29.61,23.4 29.26,23.05 28.99,23.05 28.5,22.56 28.5,22.25 28.17,21.92 25.35,21.92 24.85,21.41 24.54,21.72 23.32,20.5 23.32,19.57 v22.8,19.05
PREVGH
  Top 0.15: J1.21 10.94,13.19 11.23,13.19 11.44,12.98 11.57,12.98 11.73,12.82 11.73,12.56 12.37,11.92 12.37,11.06 12.42,11.01 13.45,11.01 EPD_C9.2 13.74,11.3 13.74,11.83 16.11,11.83 16.16,11.88 16.9,11.88 16.98,11.8 16.98,10.24 D5.1
PREVGL
  Top 0.15: J1.23 10.94,12.19 11.23,12.19 11.46,11.96 11.46,11.01 11.37,10.92 11.37,10.46 12.22,9.61 12.3,9.61 12.59,9.32 12.59,8.82 13,8.41 EPD_C11.2 13.43,8.1 13.43,7.28 13.72,6.99 14.85,6.99 D2.2
RESE
  Top 0.127: R1_EP_DR.2 14.89,25.94 14.89,24.54 13.74,23.4 Q3.2
  Top 0.15: J1.3 11.73,22.34 12.78,23.39 Q3.2
RESET  (via drill 0.2, 0.35)
  Top 0.127: J2.6 40.41,11.21 40.92,10.7 41.94,10.7 44.1,8.54 44.1,4.6 43.72,4.22 TP_RESET.TP
  Top 0.15: v39.84,17.37 40.94,16.27 42.83,16.27 42.99,16.11 42.99,16.04 42.77,15.82 v42.34,15.82 | v41.72,13.38 41.72,12.97 40.37,11.62 J2.6
  Bottom 0.15: U1.P$AC13 32.15,24.3 32.87,25.02 36.27,25.02 37.91,23.38 37.91,19.66 39.84,17.73 v39.84,17.37 | v42.34,15.82 42.34,15.43 43.04,14.73 43.04,14.18 42.55,13.69 42.55,13.62 42.52,13.59 41.93,13.59 v41.72,13.38
  other vias: 32.06,24.3
SCK  (via drill 0.3)
  Top 0.127: v33.41,17.76 33.36,17.81 33.18,17.81 33.05,17.94 32.92,17.81 32.67,17.81 32.54,17.94 32.54,18.07 32.29,18.32 U1.P$A12 | v13.94,17.63 13.61,17.3 10.82,17.3 J1.13
  Bottom 0.127: v33.41,17.76 33.25,17.76 30.85,15.36 16.21,15.36 v13.94,17.63
SCL  (via drill 0.2, 0.3)
  Top 0.127: v39.91,25.94 40.41,25.94 40.54,25.81 40.54,25.69 40.29,25.43 IC4.C1 | v27.08,23.15 26.7,22.77 26.32,22.77 U3.7 | R4.1 30,8.16 30,8.54 R17.2 29.87,8.67 29.49,8.67 28.73,7.91 27.97,7.91 | 27.46,10.19 27.46,8.41 27.97,7.91 | 27.46,10.19 27.46,13.88 23.78,17.56 23.56,17.56 23.27,17.85 23.27,19.34 23.09,19.52 22.18,19.52 IC1.B1 | 27.97,7.91 27.97,7.27 TP_SCL.TP 27.97,7.91 | v30.89,10.19 31.14,10.45 31.14,10.83 IC3.12 | 27.46,10.19 v27.59,10.19
  Top 0.15: U1.P$M2 34.83,21.57 v34.95,21.57
  Route2 0.15: v34.95,21.57 34.95,21.73 35.41,22.19 35.41,22.74 35.59,22.92 36.63,22.92 36.65,22.9 37.15,22.9 37.89,23.64 37.89,23.87 38.19,24.17 38.19,24.37 39.17,25.35 39.78,25.35 39.91,25.48 v39.91,25.94
  Bottom 0.127: v27.08,23.15 27.97,23.15 30.26,25.43 31.27,25.43 31.78,25.94 v39.91,25.94 39.91,19.84 40.29,19.46 40.29,16.75 38.42,14.89 35.72,14.89 31.02,10.19 v30.89,10.19 v27.59,10.19
SDA  (via drill 0.2, 0.3)
  Top 0.127: 22.51,19.84 23.14,19.84 23.75,19.24 R2.1 23.78,19.08 23.91,19.08 24.16,18.83 24.16,18.29 27.28,15.17 27.28,15.09 v27.08,14.89 | 22.51,19.84 22.13,19.84 IC1.C1 | v26.32,23.78 26.32,23.27 U3.8 | 22.51,19.84 v22.64,19.97 | v35.84,21.24 35.34,21.24 U1.P$L1 | v36.48,16.67 v37.11,17.3 | v31.02,11.84 31.65,11.21 31.78,11.34 | 31.78,11.34 32.54,10.57 32.54,9.3 R18.2 | 31.78,11.34 IC3.2 | v37.11,3.72 38.13,2.7 TP_SDA.TP
  Top 0.15: IC4.B2 39.69,24.83 v39.63,24.83
  Route2 0.15: v39.63,24.83 39.63,24.33 38.86,22.92 37.68,22.92 37.07,22.31 37.07,22.25 36.06,21.24 v35.84,21.24
  Bottom 0.127: v26.32,23.78 22.64,20.1 v22.64,19.97 | v35.84,21.24 35.84,18.57 v37.11,17.3 | v36.48,16.67 35.84,16.67 v31.02,11.84 28.6,11.84 | v37.11,3.72 36.73,3.72 30.76,9.68 27.46,9.68 27.08,10.07 27.08,10.32 28.6,11.84 | v27.08,14.89 27.08,13.37 28.6,11.84
SWDCLK  (via drill 0.3)
  Top 0.127: v27.94,23.7 27.94,23.59 28.42,23.59 28.6,23.78 28.73,23.78 U1.P$AA24 | v45.37,23.27 45.5,23.15 45.5,22.26 44.73,21.5 44.35,21.5 44.23,21.37 44.23,18.07 44.48,17.81 44.48,17.05 42.32,14.89 39.02,14.89 38.13,14 38.13,12.99 38.26,12.86 38.13,12.73 38.13,12.58 38.49,12.22 38.49,11.99 39.15,11.34 J2.4 39.02,11.21 v39.53,10.7 | v41.3,3.59 41.3,3.46 41.69,3.08 41.69,2.32 TP_SWDCLK.TP
  Bottom 0.127: v27.94,23.7 27.94,24.39 29.62,26.07 31.14,26.07 31.52,26.45 39.4,26.45 39.65,26.7 40.8,26.7 44.23,23.27 v45.37,23.27 | v41.3,3.59 41.3,4.22 38.13,7.4 38.13,9.3 v39.53,10.7
SWDIO  (via drill 0.2, 0.3)
  Top 0.127: v28.35,24.16 28.35,24.29 28.48,24.42 28.6,24.29 28.73,24.29 U1.P$AC24 | v38.08,12.05 38.08,11.38 J2.2 | v40.92,5.37 TP_SWDIO.TP
  Bottom 0.127: v28.35,24.16 28.6,24.16 30.26,25.81 31.27,25.81 31.65,26.19 39.53,26.19 39.78,26.45 40.03,26.45 40.54,25.94 40.54,16.41 38.13,14 38.13,12.99 38.26,12.86 38.13,12.73 38.13,12.35 38.25,12.23 | v38.08,12.05 38.25,12.23 | v40.92,5.37 40.92,7.02 41.43,7.53 41.43,8.67 40.67,9.43 40.67,10.19 39.15,11.72 38.76,11.72 38.25,12.23
SWO
  Top 0.127: U1.P$AD22 29.75,24.8 29.37,25.18 29.11,25.18 28.86,25.43 28.86,26.7 30,27.84 30.64,27.84 TP_SWO.TP
VBAT
  Top 0.127: U3.3 24.41,22.26 24.41,22.64 U3.2 24.29,22.77 23.78,22.77 23.4,22.38 22.38,22.38 22.25,22.51 22.25,22.89 | IC1.C2 21.62,19.84 21.24,19.84 20.48,20.61 20.48,21.88 20.86,22.26 20.86,22.77 TP_VBAT.TP | 22.25,22.89 20.98,22.89 TP_VBAT.TP | 22.25,22.89 22.64,22.89 C27.2 | C37.2 19.46,24.29 20.1,24.29 20.86,23.53 20.86,22.89 TP_VBAT.TP
VBUS  (via drill 0.3)
  Top 0.127: 35.72,25.05 35.84,25.05 36.1,24.8 36.48,24.8 C21.1 | 35.72,25.05 35.21,25.05 34.95,24.8 34.83,24.8 U1.P$AD2 | 35.08,28.86 35.08,28.48 C42.1 | 35.08,28.86 35.21,28.99 35.46,28.99 35.84,29.37 35.84,30 D3.5 35.72,30.13 35.72,30.64 36.1,31.02 37.11,31.02 37.37,30.77 37.37,29.24 36.61,28.48 36.61,26.83 35.72,25.94 35.72,25.05 | 35.08,28.86 34.95,28.99 32.8,28.99 C43.1 32.67,28.99 32.03,28.99 30.13,30.89 25.94,30.89 24.79,29.75 | IC1.A2 21.62,18.96 21.34,18.67 18.56,18.67 v18.35,18.46 18.35,18.41 17.37,17.43 17.1,17.43 C38.2 | 24.79,29.75 25.43,29.11 25.43,28.73 J4.A4_B9 | 24.79,29.75 23.91,30.64 21.75,30.64 21.37,30.26 21.37,30 20.6,29.24 20.6,28.73 J4.A9_B4 20.73,28.61 20.86,28.48 20.86,27.97 20.6,27.72 20.6,27.38 v20.68,27.38
  Bottom 0.127: v18.35,18.46 18.35,25.06 v20.68,27.38
VREG
  Top 0.127: 3.2,29.62 2.82,29.62 IC9.A1 | 3.2,29.62 3.46,29.62 IC9.A3 | 3.2,29.62 IC9.A2 | IC1.B2 21.62,19.46 19.46,19.46 C39.1 19.33,19.34 18.95,19.34 18.44,19.84 18.44,24.54 14.63,28.35 14.63,29.88 TP_VREG.TP
  Top 0.15: C24.2 8.42,31.9 8.42,30.79 8.75,30.79 C23.2 9.08,31.06 9.11,31.08 9.11,32.47 9.2,32.56 9.2,33.96 9.65,34.41 11.52,34.41 11.59,34.34 13.77,34.34 13.88,34.23 15.19,34.23 15.21,34.25 16.19,33.27 16.19,31.91 15.7,31.42 15.7,30.85 15.89,30.66 15.16,29.93 TP_VREG.TP
  Top 0.305: IC9.A3 3.59,29.74 4.13,30.28 4.89,30.28 5.9,31.29 7.76,31.29 C24.2